# Altium schematic sheet Wireless.SchDoc: Init Title in DocParam
size A4; Organization: Use Organization_Name in ProjParam; Address1: Eliot Ferragni; Address2: STI-IMT-LSRO; Address3: EPFL; Address4: CH-1015 LAUSANNE; DocumentNumber: 7; Revision: A; SheetNumber: 7; SheetTotal: 10; ApprovedBy: Init ApprovedBy in DocParam; CheckedBy: Init CheckedBy in DocParam; Author: Init Author in DocParam; CompanyName: Init CompanyName in DocParam; DrawnBy: Init DrawBy in DocParam; Engineer: Init Engineer in DocParam; Title2: Init Title2 in DocParam; DocumentName: Init DocumentName in DocParam; ProjectName: Init ProjectName in DocParam
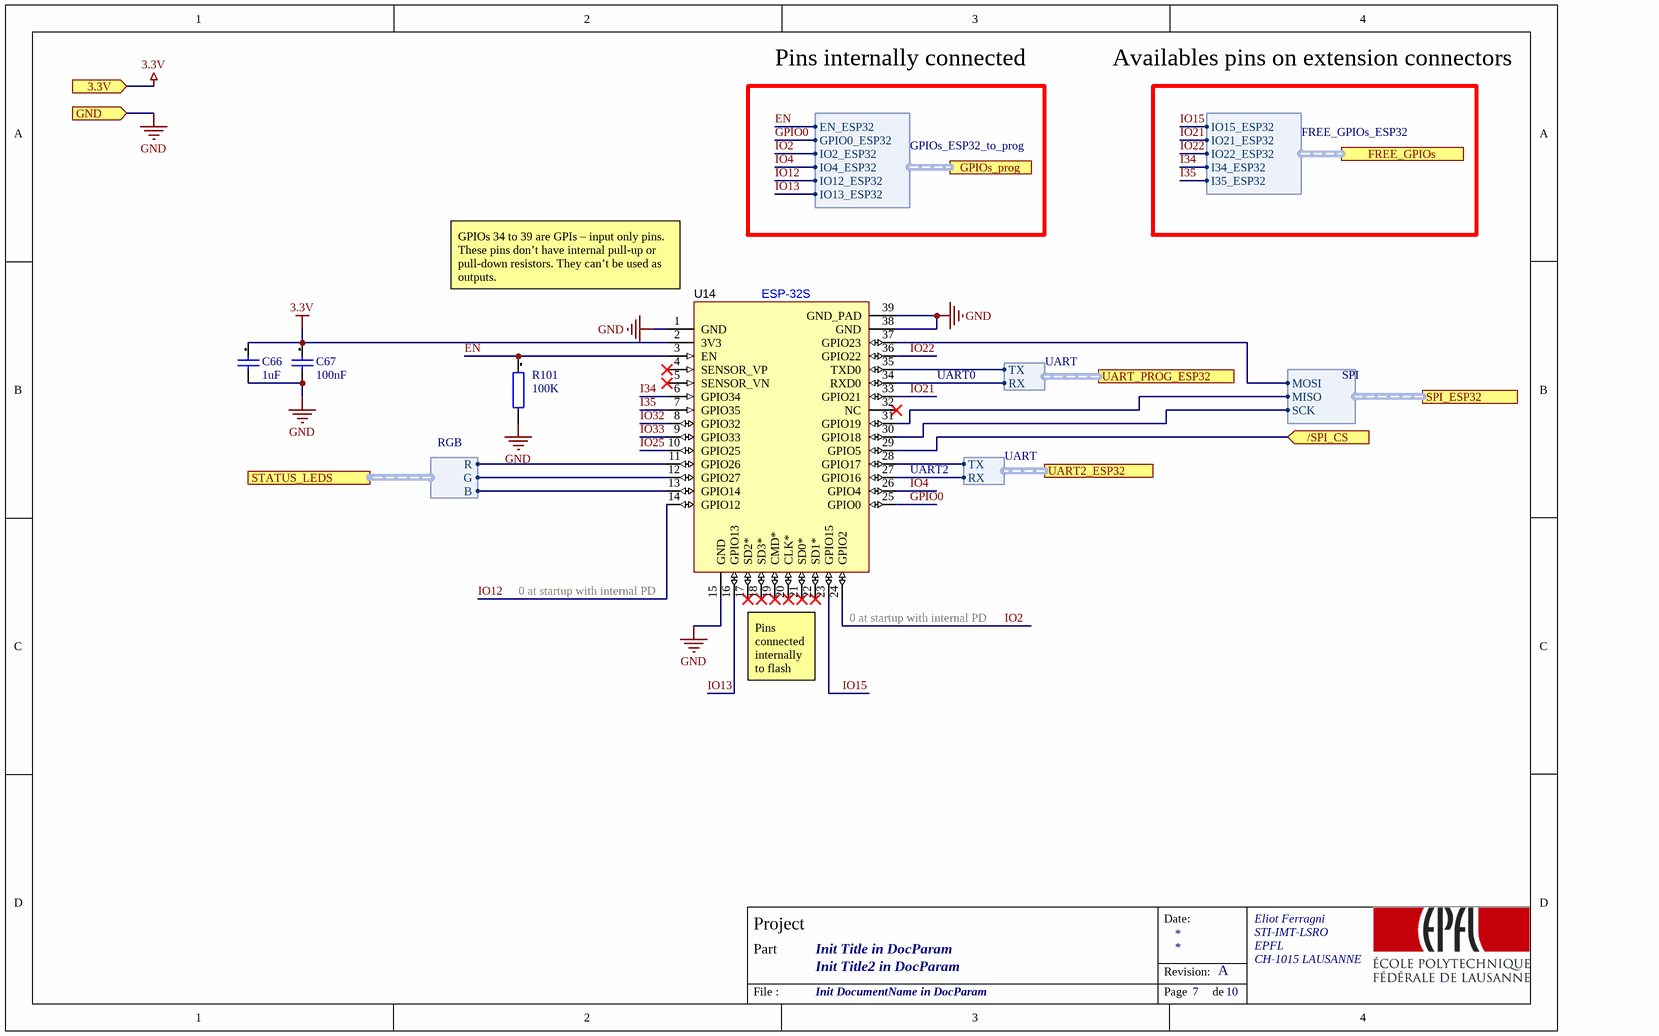
[diagram p0: Wireless.SchDoc]

## Parts
C66  1uF  [CAPC0201(0603)33_L]
C67  100nF  [CAPC0201(0603)33_L]
R101  100K  [RESC0201(0603)_L]
U14  ESP-32S  [ESP-32S]

## Ports
3.3V (in), /SPI_CS (in), FREE_GPIOs (harness FREE_GPIOs_ESP32), GND (in), GPIOs_prog (harness GPIOs_ESP32_to_prog), SPI_ESP32 (harness SPI), STATUS_LEDS (harness RGB), UART2_ESP32 (harness UART), UART_PROG_ESP32 (harness UART)

## Harnesses
SPI: MISO, MOSI, SCK
UART: RX, TX
RGB: R, G, B
FREE_GPIOs_ESP32: IO22_ESP32, IO21_ESP32, I34_ESP32, IO15_ESP32, I35_ESP32
GPIOs_ESP32_to_prog: IO4_ESP32, IO2_ESP32, IO12_ESP32, GPIO0_ESP32, IO13_ESP32, EN_ESP32

## Nets
3.3V: C66.1 C67.1 U14.2(3V3) ; port 3.3V
GND: C66.2 C67.2 R101.2 U14.1(GND) U14.15(GND) U14.38(GND) U14.39(GND_PAD) ; port GND
/SPI_CS: U14.29(GPIO5) ; port /SPI_CS
EN: R101.1 U14.3(EN) ; port GPIOs_prog.EN_ESP32
GPIO0: U14.25(GPIO0) ; port GPIOs_prog.GPIO0_ESP32
I34: U14.6(GPIO34) ; port FREE_GPIOs.I34_ESP32
I35: U14.7(GPIO35) ; port FREE_GPIOs.I35_ESP32
IO2: U14.24(GPIO2) ; port GPIOs_prog.IO2_ESP32
IO4: U14.26(GPIO4) ; port GPIOs_prog.IO4_ESP32
IO12: U14.14(GPIO12) ; port GPIOs_prog.IO12_ESP32
IO13: U14.16(GPIO13) ; port GPIOs_prog.IO13_ESP32
IO15: U14.23(GPIO15) ; port FREE_GPIOs.IO15_ESP32
IO21: U14.33(GPIO21) ; port FREE_GPIOs.IO21_ESP32
IO22: U14.36(GPIO22) ; port FREE_GPIOs.IO22_ESP32
IO25: U14.10(GPIO25)
IO32: U14.8(GPIO32)
IO33: U14.9(GPIO33)
NetU14_11: U14.11(GPIO26) ; port STATUS_LEDS.R
NetU14_12: U14.12(GPIO27) ; port STATUS_LEDS.G
NetU14_13: U14.13(GPIO14) ; port STATUS_LEDS.B
NetU14_27: U14.27(GPIO16) ; port UART2_ESP32.RX
NetU14_28: U14.28(GPIO17) ; port UART2_ESP32.TX
NetU14_30: U14.30(GPIO18) ; port SPI_ESP32.SCK
NetU14_31: U14.31(GPIO19) ; port SPI_ESP32.MISO
NetU14_34: U14.34(RXD0) ; port UART_PROG_ESP32.RX
NetU14_35: U14.35(TXD0) ; port UART_PROG_ESP32.TX
NetU14_37: U14.37(GPIO23) ; port SPI_ESP32.MOSI

Not connected (* = marked no-connect by the designer): U14 4(SENSOR_VP)* 5(SENSOR_VN)* 17(SD2*)* 18(SD3*)* 19(CMD*)* 20(CLK*)* 21(SD0*)* 22(SD1*)* 32(NC)*

## Notes on the sheet
- Pins internally connected
- Availables pins on extension connectors
- (near U14) GPIOs 34 to 39 are GPIs – input only pins. These pins don’t have internal pull-up or pull-down resistors. They can’t be used as outputs.
- UART0
- (near U14) UART2
- (near U14) 0 at startup with internal PD
- (near U14) Pins connected internally to flash
- Date:
- Project
- Part
- Revision:
- File :
- Page
- de

## Library data of the parts
C66 C67 = TBD Capacitor[[/\]]0201[[/\]]1: Capacitor TBD 0201; Preference: 1; Currentie: CHF; Size: 0201; Footprint Acort: 0201; ROHS: True; DateLastUpdate: 2018-10-19 / 8:59:52 AM
R101 = TBD[[/\]]0201[[/\]]1: Resistor ToDo 0201; Preference: 1; Currentie: CHF; Size: 0201; Footprint Acort: 0201; ROHS: True; DateLastUpdate: 2018-10-19 / 9:06:49 AM
U14 = ESP-32S: Wi-Fi BT BLE MCU Module; MANUFACTURER: TEXAS INSTRUMENTS; POPULATE: Y; CONSIGNED: Y; VALUE: ESP-32S